# EAGLE design I2C_matrix_V0.1 (EAGLE 6.5.0)
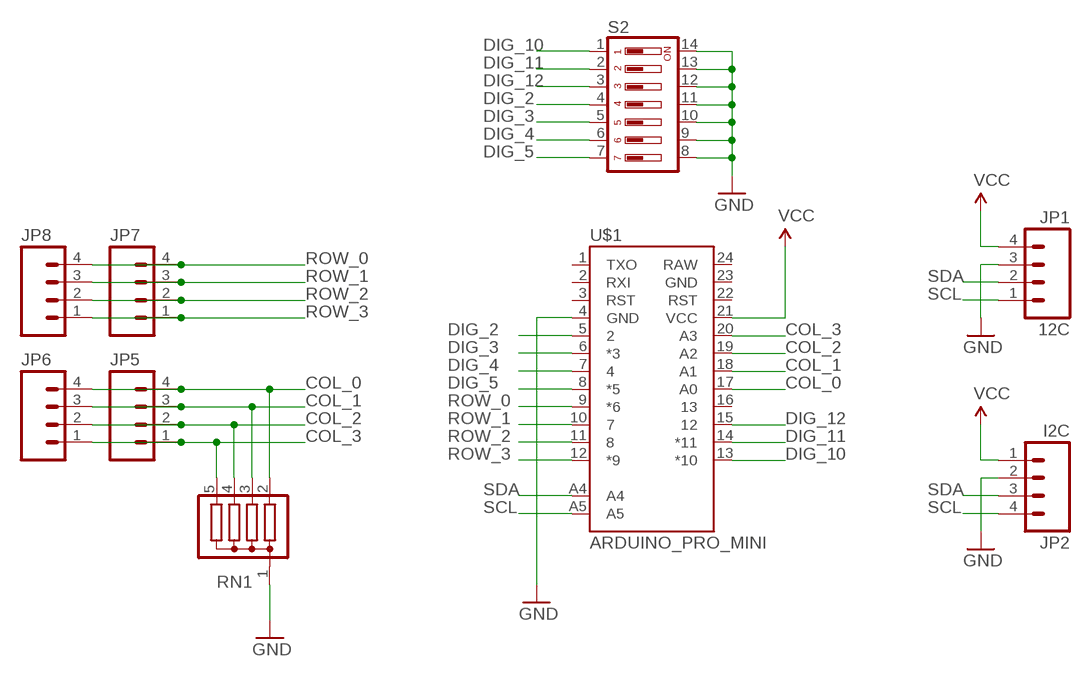
[diagram p0: schematic, sheet 1]

## Parts
JP1  12C  M04SMD_LONG  [1X04-SMD_LONG]
JP2  I2C  M04SMD_LONG  [1X04-SMD_LONG]
JP5  M04LONGPADS  [1X04_LONGPADS]
JP6  M04LONGPADS  [1X04_LONGPADS]
JP7  M04LONGPADS  [1X04_LONGPADS]
JP8  M04LONGPADS  [1X04_LONGPADS]
RN1  G04R  [SIL5]
S2  DIP07YL  [DIP07YL]
U$1  ARDUINO_PRO_MINI  [ARDUINO_PRO_MINI]

## Nets
COL_0: JP5.4 JP6.4 RN1.2 U$1.17(A0)
COL_1: JP5.3 JP6.3 RN1.3 U$1.18(A1)
COL_2: JP5.2 JP6.2 RN1.4 U$1.19(A2)
COL_3: JP5.1 JP6.1 RN1.5 U$1.20(A3)
DIG_2: S2.4 U$1.5
DIG_3: S2.5 U$1.6(*3)
DIG_4: S2.6 U$1.7
DIG_5: S2.7 U$1.8(*5)
DIG_10: S2.1 U$1.13(*10)
DIG_11: S2.2 U$1.14(*11)
DIG_12: S2.3 U$1.15
GND: JP1.3 JP2.2 RN1.1 S2.8 S2.9 S2.10 S2.11 S2.12 S2.13 S2.14 U$1.4(GND)
ROW_0: JP7.4 JP8.4 U$1.9(*6)
ROW_1: JP7.3 JP8.3 U$1.10
ROW_2: JP7.2 JP8.2 U$1.11
ROW_3: JP7.1 JP8.1 U$1.12(*9)
SCL: JP1.1 JP2.4 U$1.A5
SDA: JP1.2 JP2.3 U$1.A4
VCC: JP1.4 JP2.1 U$1.21(VCC)
Unconnected: U$1.1(TXO) U$1.2(RXI) U$1.3(RST) U$1.16 U$1.22(RST) U$1.23(GND) U$1.24(RAW)

## Library data of the parts
JP1 JP2 JP5-JP8 = SparkFun-Connectors:M04: Header 4 Standard 4-pin 0.1" header. Use with straight break away headers (SKU : PRT-00116), right angle break away headers (PRT-00553), swiss pins (PRT-00743), machine pins (PRT-00117), and female headers (PRT-00115). Molex polarized connector foot print use with SKU : PRT-08231 with associated crimp pins and housings. 1MM SMD Version SKU: PRT-10208
RN1 = resistor-sil:G04R: SIL RESISTOR; OC_FARNELL: unknown; OC_NEWARK: unknown
S2 = switch-dil:DIP07YL: DIL/CODE SWITCH; OC_FARNELL: unknown; OC_NEWARK: unknown
U$1 = SparkFun-Boards:ARDUINO_PRO_MINI

## Board
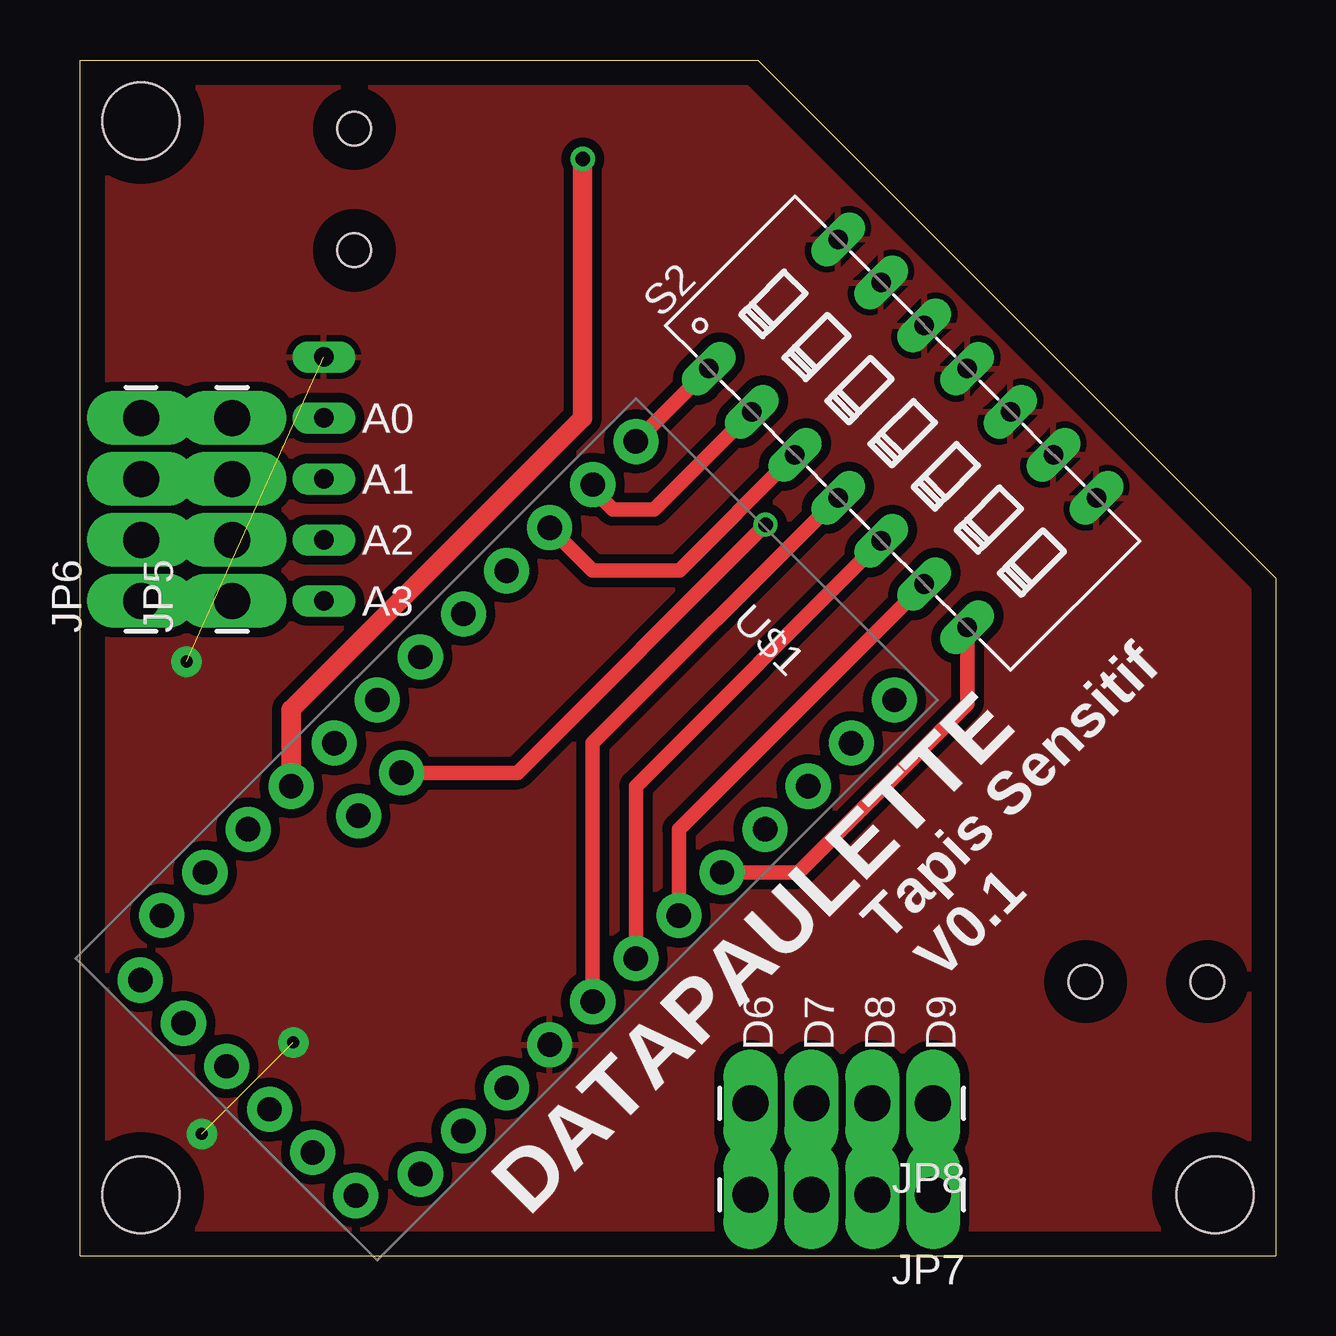
[diagram p1: board, top side]
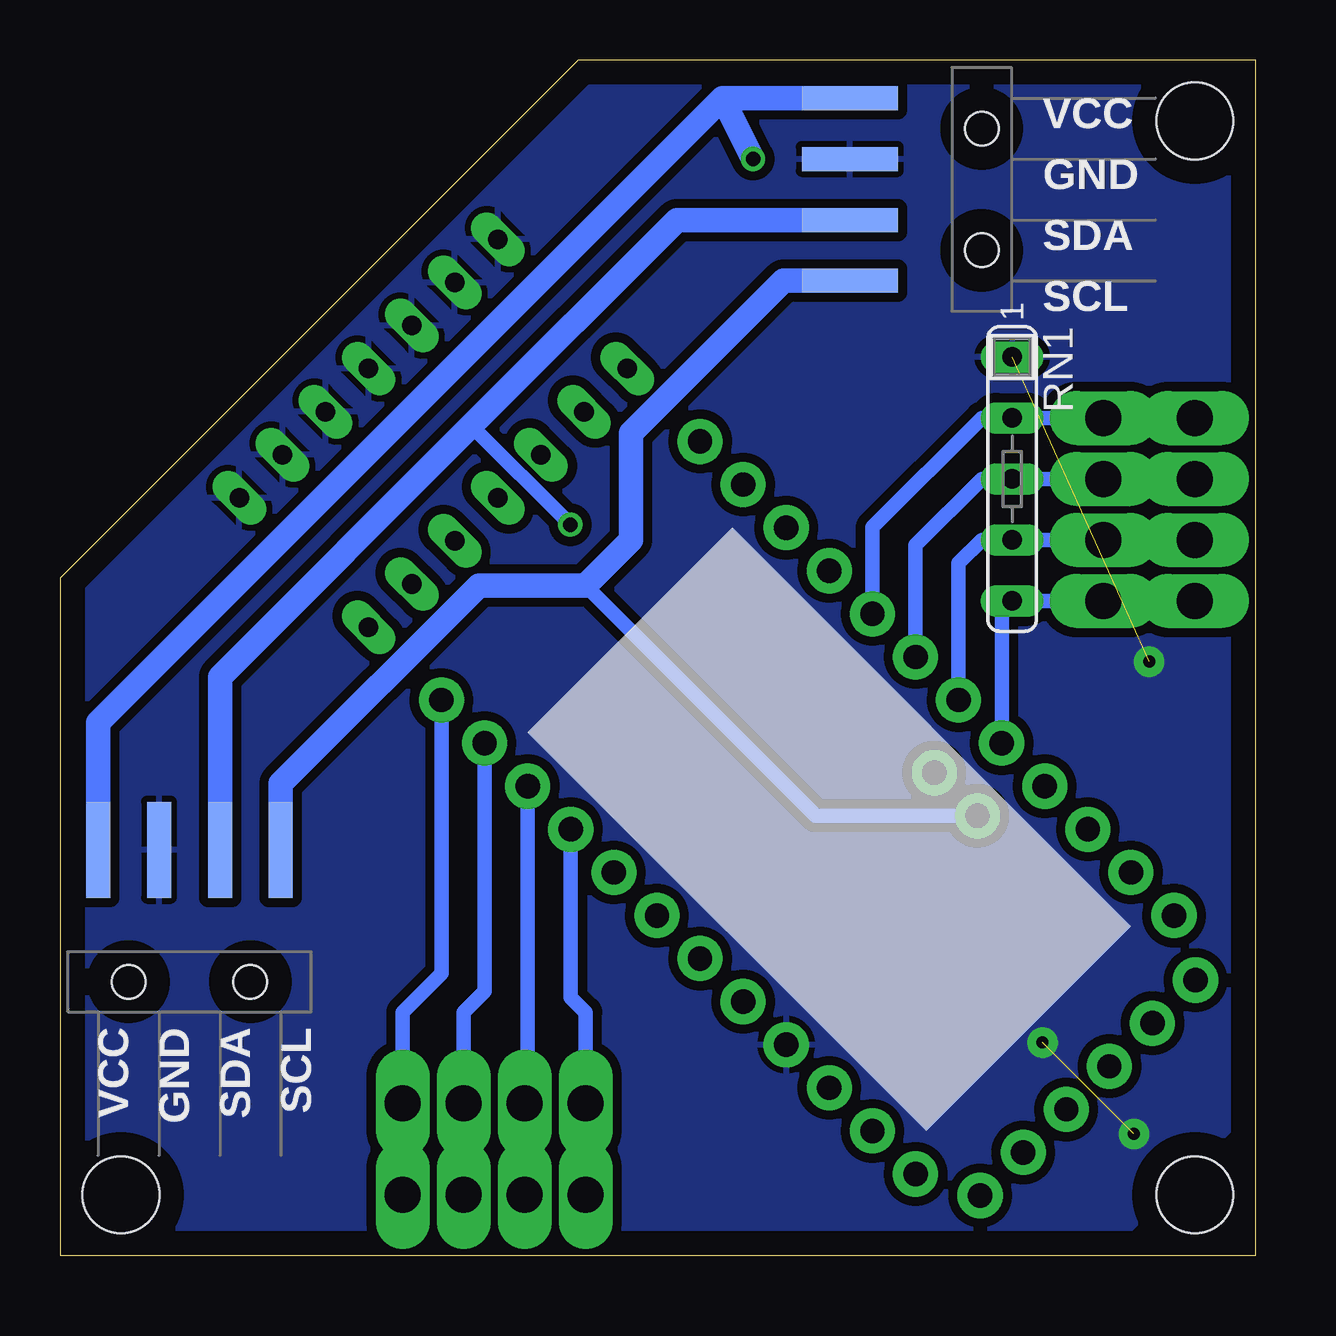
[diagram p2: board, bottom side, seen from below]

Size 49.85 x 49.85 mm. Coordinates in mm from the lower left corner, seen from the top.
Outline: 0,0 0,49.85 28.26,49.85 49.85,28.26 49.85,0 0,0
Copper layers (1*16): Top 0.035mm / dielectric 1.5mm / Bottom 0.035mm
Design rules "default *": minimum track width 10mil, minimum drill 24mil, track to track 15mil, track to pad 15mil, pad to pad 15mil, via to via 15mil, smd to smd 15mil, copper to edge 40mil, drill to drill 8mil, minimum pad ring 10mil, minimum via ring 8mil, stop-mask expansion 4mil, vias tented up to drill 0mil, thermal gap 10mil
Holes 3.2 mm at 2.54,47.31 2.54,2.54 47.31,2.54

### Footprints (pad centres in the part's own frame; a part is rotated, then mirrored left to right if it is on the bottom)
1X04-SMD_LONG = smd 1 x 4: 1 -3.81,5.5; 2 -1.27,5.5; 3 1.27,5.5; 4 3.81,5.5 | hole 1.4: -2.54,0; 2.54,0
1X04_LONGPADS = drill 1.5 pad 1.676 long: 1 0,0; 2 2.54,0; 3 5.08,0; 4 7.62,0
SIL5 = drill 0.813 long: 1 -5.08,0; 2 -2.54,0; 3 0,0; 4 2.54,0; 5 5.08,0
DIP07YL = drill 0.813 long: 1 -7.62,-3.81; 2 -5.08,-3.81; 3 -2.54,-3.81; 4 0,-3.81; 5 2.54,-3.81; 6 5.08,-3.81; 7 7.62,-3.81; 8 7.62,3.81; 9 5.08,3.81; 10 2.54,3.81; 11 0,3.81; 12 -2.54,3.81; 13 -5.08,3.81; 14 -7.62,3.81
ARDUINO_PRO_MINI = drill 1.016 pad 1.88: 1 -7.62,12.7; 2 -7.62,10.16; 3 -7.62,7.62; 4 -7.62,5.08; 5 -7.62,2.54; 6 -7.62,0; 7 -7.62,-2.54; 8 -7.62,-5.08; 9 -7.62,-7.62; 10 -7.62,-10.16; 11 -7.62,-12.7; 12 -7.62,-15.24; 13 7.62,-15.24; 14 7.62,-12.7; 15 7.62,-10.16; 16 7.62,-7.62; 17 7.62,-5.08; 18 7.62,-2.54; 19 7.62,0; 20 7.62,2.54; 21 7.62,5.08; 22 7.62,7.62; 23 7.62,10.16; 24 7.62,12.7; A4 4.763,1.429; A5 4.763,3.969; BLK -6.35,15.24; GND -3.81,15.24; GRN 6.35,15.24; RXI 1.27,15.24; TXO 3.81,15.24; VCC -1.27,15.24

### Placement (x,y rotation side)
JP1  11.43,44.45 90 bottom
JP2  44.45,11.43 0 bottom
JP5  6.35,27.3 90 top
JP6  2.54,27.3 90 top
JP7  35.56,2.54 180 top
JP8  35.56,6.35 180 top
RN1  10.16,32.38 270 bottom
S2  34.29,34.29 315 top
U$1  17.78,17.78 135 top

### Tracks (layer width: path | path; a pad name or v marks a point on that pad's centre or on a via)
COL_0
  Bottom 0.61: JP6.4 JP5.4 RN1.2 11.43,34.92 15.98,30.37 U$1.17
COL_1
  Bottom 0.61: JP6.3 JP5.3 RN1.3 11.43,32.38 14.19,29.63 U$1.18
COL_2
  Bottom 0.61: JP6.2 JP5.2 RN1.4 11.43,29.84 12.39,28.88 U$1.19
COL_3
  Bottom 0.61: JP6.1 JP5.1 RN1.5 10.6,26.87 U$1.20
DIG_2
  Top 0.61: S2.4 21.37,21.37 U$1.5
DIG_3
  Top 0.61: S2.5 23.17,19.58 U$1.6
DIG_4
  Top 0.61: S2.6 24.96,17.78 U$1.7
DIG_5
  Top 0.61: S2.7 36.98,23.01 29.95,15.98 U$1.8
DIG_10
  Top 0.61: S2.1 U$1.13
DIG_11
  Top 0.61: S2.2 23.93,31.11 22.23,31.11 21.37,31.97 U$1.14
DIG_12
  Top 0.61: U$1.15 21.35,28.57 24.98,28.57 S2.3
GND  (via drill 0.5 pad 1.27)  (2 unrouted)
  other vias: 8.89,8.89 4.45,24.77 5.08,5.08
  pour Bottom: 0,49.85 28.26,49.85 49.85,28.26 49.85,0 6.35,0 0,6.35
  pour Top: 0,49.85 28.26,49.85 49.85,28.26 49.85,0 0,0
ROW_0
  Bottom 0.61: JP7.4 JP8.4 27.94,10.16 28.56,10.78 U$1.9
ROW_1
  Bottom 0.61: JP7.3 JP8.3 30.35,6.48 U$1.10
ROW_2
  Bottom 0.61: JP7.2 JP8.2 33.02,10.16 32.15,11.03 U$1.11
ROW_3
  Bottom 0.61: JP7.1 JP8.1 35.56,10.16 33.94,11.78 U$1.12
SCL
  Bottom 0.61: U$1.A5 18.34,18.34 27.94,27.94
  Bottom 1.016: JP1.1 19.68,40.64 26.04,34.29 26.04,29.84 27.94,27.94 32.38,27.94 40.64,19.68 JP2.4
SDA  (via drill 0.6)
  Top 0.61: v28.57,30.48 18.23,20.14 U$1.A4
  Bottom 0.61: 32.7,34.61 v28.57,30.48
  Bottom 1.016: JP1.2 24.13,43.18 32.7,34.61 43.18,24.13 JP2.3
VCC  (via drill 0.6)
  Top 0.813: U$1.21 8.8,22.77 20.95,34.92 v20.95,45.72
  Bottom 1.016: JP1.4 22.23,48.26 | 22.23,48.26 48.26,22.23 JP2.1 | 22.23,48.26 v20.95,45.72

### Text on the board
_tsilk: A0 | A1 | A2 | A3 | Tapis Sensitif | V0.1 | D6 | D7 | D8 | D9 | DATAPAULETTE
_bsilk: VCC | GND | SDA | SCL | SCL | SDA | GND | VCC